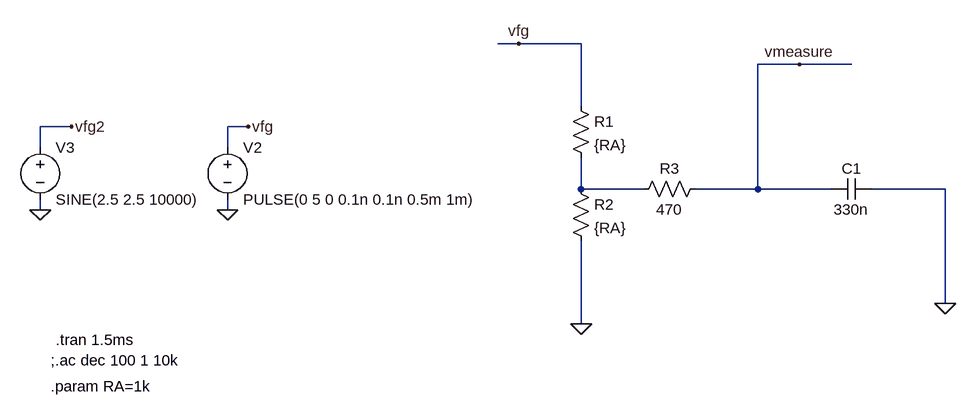
[diagram p0: schematic Task1Schematic.asc]
Task1Schematic.asc, the LTspice schematic file:
Version 4
SHEET 1 1220 680
WIRE 544 -48 512 -48
WIRE 640 -48 544 -48
WIRE 976 -16 912 -16
WIRE 1056 -16 976 -16
WIRE 640 48 640 -48
WIRE -144 80 -192 80
WIRE 128 80 96 80
WIRE -192 112 -192 80
WIRE 96 112 96 80
WIRE 640 176 640 128
WIRE 736 176 640 176
WIRE 912 176 912 -16
WIRE 912 176 816 176
WIRE 1024 176 912 176
WIRE 1200 176 1088 176
WIRE -192 208 -192 192
WIRE 96 208 96 192
WIRE 1200 352 1200 176
WIRE 640 384 640 256
FLAG -192 208 0
FLAG 96 208 0
FLAG 1200 352 0
FLAG 976 -16 vmeasure
FLAG 128 80 vfg
FLAG -144 80 vfg2
FLAG 640 384 0
FLAG 544 -48 vfg
SYMBOL voltage -192 96 R0
WINDOW 123 0 0 Left 0
WINDOW 39 0 0 Left 0
SYMATTR InstName V3
SYMATTR Value SINE(2.5 2.5 10000)
SYMBOL voltage 96 96 R0
WINDOW 123 0 0 Left 0
WINDOW 39 0 0 Left 0
SYMATTR InstName V2
SYMATTR Value PULSE(0 5 0 0.1n 0.1n 0.5m 1m)
SYMBOL res 624 32 R0
SYMATTR InstName R1
SYMATTR Value {RA}
SYMBOL res 624 160 R0
SYMATTR InstName R2
SYMATTR Value {RA}
SYMBOL res 832 160 R90
WINDOW 0 0 56 VBottom 2
WINDOW 3 32 56 VTop 2
SYMATTR InstName R3
SYMATTR Value 470
SYMBOL cap 1088 160 R90
WINDOW 0 0 32 VBottom 2
WINDOW 3 32 32 VTop 2
SYMATTR InstName C1
SYMATTR Value 330n
TEXT -176 480 Left 2 !.param RA=1k
TEXT -168 408 Left 2 !.tran 1.5ms
TEXT -176 440 Left 2 !;.ac dec 100 1 10k

The netlist it stands for:
* Task1Schematic.asc
V3 vfg2 0 SINE(2.5 2.5 10000)
V2 vfg 0 PULSE(0 5 0 0.1n 0.1n 0.5m 1m)
R1 vfg N001 {RA}
R2 N001 0 {RA}
R3 vmeasure N001 470
C1 0 vmeasure 330n
.param RA=1k
.tran 1.5ms
;.ac dec 100 1 10k
.backanno
.end